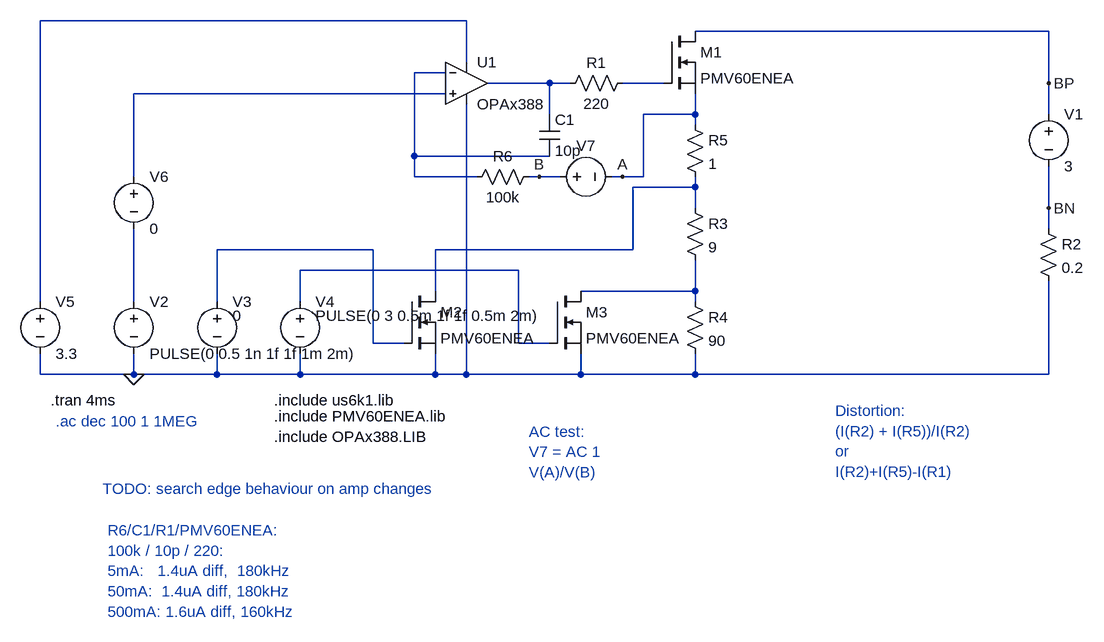
[diagram p0: schematic clipsearch.asc]
clipsearch.asc, the LTspice schematic file:
Version 4
SHEET 1 2884 9200
WIRE 208 -80 -448 -80
WIRE 1104 -64 560 -64
WIRE 208 -16 208 -80
WIRE 176 0 128 0
WIRE 336 16 240 16
WIRE 368 16 336 16
WIRE 512 16 448 16
WIRE 1104 16 1104 -64
WIRE 176 32 -304 32
WIRE 336 64 336 16
WIRE 560 64 560 32
WIRE 560 64 480 64
WIRE 1104 64 1104 16
WIRE 560 80 560 64
WIRE 128 128 128 0
WIRE 336 128 128 128
WIRE -304 160 -304 32
WIRE 128 160 128 128
WIRE 224 160 128 160
WIRE 320 160 304 160
WIRE 352 160 320 160
WIRE 448 160 432 160
WIRE 480 160 480 64
WIRE 480 160 448 160
WIRE 560 176 560 160
WIRE 560 176 464 176
WIRE 560 208 560 176
WIRE 1104 208 1104 144
WIRE 1104 240 1104 208
WIRE 64 272 -176 272
WIRE 464 272 464 176
WIRE 464 272 160 272
WIRE 288 304 -48 304
WIRE 160 336 160 272
WIRE 560 336 560 288
WIRE 560 336 384 336
WIRE -448 352 -448 -80
WIRE -304 352 -304 240
WIRE -176 352 -176 272
WIRE -48 352 -48 304
WIRE 560 352 560 336
WIRE 64 416 64 272
WIRE 112 416 64 416
WIRE 288 416 288 304
WIRE 336 416 288 416
WIRE -448 464 -448 432
WIRE -304 464 -304 432
WIRE -304 464 -448 464
WIRE -176 464 -176 432
WIRE -176 464 -304 464
WIRE -48 464 -48 432
WIRE -48 464 -176 464
WIRE 160 464 160 432
WIRE 160 464 -48 464
WIRE 208 464 208 48
WIRE 208 464 160 464
WIRE 384 464 384 432
WIRE 384 464 208 464
WIRE 560 464 560 432
WIRE 560 464 384 464
WIRE 1104 464 1104 320
WIRE 1104 464 560 464
FLAG -304 464 0
FLAG 1104 208 BN
FLAG 1104 16 BP
FLAG 448 160 A
FLAG 320 160 B
SYMBOL voltage 1104 48 R0
SYMATTR InstName V1
SYMATTR Value 3
SYMATTR SpiceLine Rser=2
SYMBOL res 1088 224 R0
SYMATTR InstName R2
SYMATTR Value 0.2
SYMBOL res 544 192 R0
SYMATTR InstName R3
SYMATTR Value 9
SYMBOL res 544 336 R0
SYMATTR InstName R4
SYMATTR Value 90
SYMBOL res 544 64 R0
SYMATTR InstName R5
SYMATTR Value 1
SYMBOL nmos 512 -64 R0
SYMATTR InstName M1
SYMATTR Value PMV60ENEA
SYMATTR Prefix X
SYMBOL res 464 0 R90
WINDOW 0 0 56 VBottom 2
WINDOW 3 32 56 VTop 2
SYMATTR InstName R1
SYMATTR Value 220
SYMBOL res 320 144 R90
WINDOW 0 0 56 VBottom 2
WINDOW 3 32 56 VTop 2
SYMATTR InstName R6
SYMATTR Value 100k
SYMBOL nmos 112 336 R0
SYMATTR InstName M2
SYMATTR Value PMV60ENEA
SYMATTR Prefix X
SYMBOL nmos 336 336 R0
SYMATTR InstName M3
SYMATTR Value PMV60ENEA
SYMATTR Prefix X
SYMBOL voltage -304 336 R0
SYMATTR InstName V2
SYMATTR Value PULSE(0 0.5 1n 1f 1f 1m 2m)
SYMBOL voltage -176 336 R0
WINDOW 3 24 38 Left 2
SYMATTR Value 0
SYMATTR InstName V3
SYMBOL voltage -48 336 R0
WINDOW 3 24 38 Left 2
SYMATTR Value PULSE(0 3 0.5m 1f 1f 0.5m 2m)
SYMATTR InstName V4
SYMBOL voltage -448 336 R0
SYMATTR InstName V5
SYMATTR Value 3.3
SYMBOL cap 320 64 R0
SYMATTR InstName C1
SYMATTR Value 10p
SYMBOL voltage -304 144 R0
SYMATTR InstName V6
SYMATTR Value 0
SYMBOL voltage 336 160 R270
WINDOW 0 32 56 VTop 2
WINDOW 3 -32 56 VBottom 2
SYMATTR InstName V7
SYMATTR Value ""
SYMATTR Value2 AC 1
SYMBOL OpAmps/opamp2 208 -48 R0
SYMATTR InstName U1
SYMATTR Value OPAx388
TEXT -432 504 Left 2 !.tran 4ms
TEXT -424 536 Left 2 ;.ac dec 100 1 1MEG
TEXT 304 552 Left 2 ;AC test: \nV7 = AC 1\nV(A)/V(B)
TEXT 776 520 Left 2 ;Distortion: \n(I(R2) + I(R5))/I(R2)\nor\nI(R2)+I(R5)-I(R1)
TEXT -344 704 Left 2 ;R6/C1/R1/PMV60ENEA: \n100k / 10p / 220:\n5mA:   1.4uA diff,  180kHz\n50mA:  1.4uA diff, 180kHz \n500mA: 1.6uA diff, 160kHz
TEXT -88 504 Left 2 !.include us6k1.lib
TEXT -88 560 Left 2 !.include OPAx388.LIB
TEXT -88 528 Left 2 !.include PMV60ENEA.lib
TEXT -352 640 Left 2 ;TODO: search edge behaviour on amp changes

The netlist it stands for:
* clipsearch.asc
V1 BP BN 3 Rser=2
R2 BN 0 0.2
R3 N006 N009 9
R4 N009 0 90
R5 A N006 1
XM1 BP N004 A PMV60ENEA  ; pins D G S
R1 N004 N003 220
R6 B N002 100k
XM2 N006 N007 0 PMV60ENEA  ; pins D G S
XM3 N009 N008 0 PMV60ENEA  ; pins D G S
V2 N010 0 PULSE(0 0.5 1n 1f 1f 1m 2m)
V3 N007 0 0
V4 N008 0 PULSE(0 3 0.5m 1f 1f 0.5m 2m)
V5 N001 0 3.3
C1 N003 N002 10p
V6 N005 N010 0
V7 B A AC 1
XU1 N005 N002 N001 0 N003 OPAx388  ; pins In+ In- V+ V- OUT
.tran 4ms
* .ac dec 100 1 1MEG
* AC test:
* V7 = AC 1
* V(A)/V(B)
* Distortion:
* (I(R2) + I(R5))/I(R2)
* or
* I(R2)+I(R5)-I(R1)
* R6/C1/R1/PMV60ENEA:
* 100k / 10p / 220:
* 5mA:   1.4uA diff,  180kHz
* 50mA:  1.4uA diff, 180kHz
* 500mA: 1.6uA diff, 160kHz
.include us6k1.lib
.include OPAx388.LIB
.include PMV60ENEA.lib
* TODO: search edge behaviour on amp changes
.backanno
.end